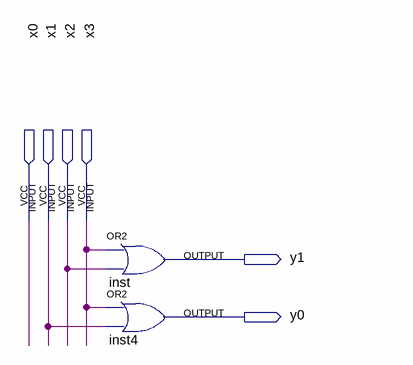
[diagram p0: schematic sheet]
// Quartus schematic CD4-2.bdf as structural Verilog: 2 symbols, 6 pins
module \CD4-2  (
  input  x0,
  input  x1,
  input  x2,
  input  x3,
  output y1,
  output y0
);

  or inst (y1, x3, x2);
  or inst4 (y0, x3, x1);
endmodule
